# EAGLE design nonregulation-level-shifter-mk-2.1 (EAGLE 7.5.0)
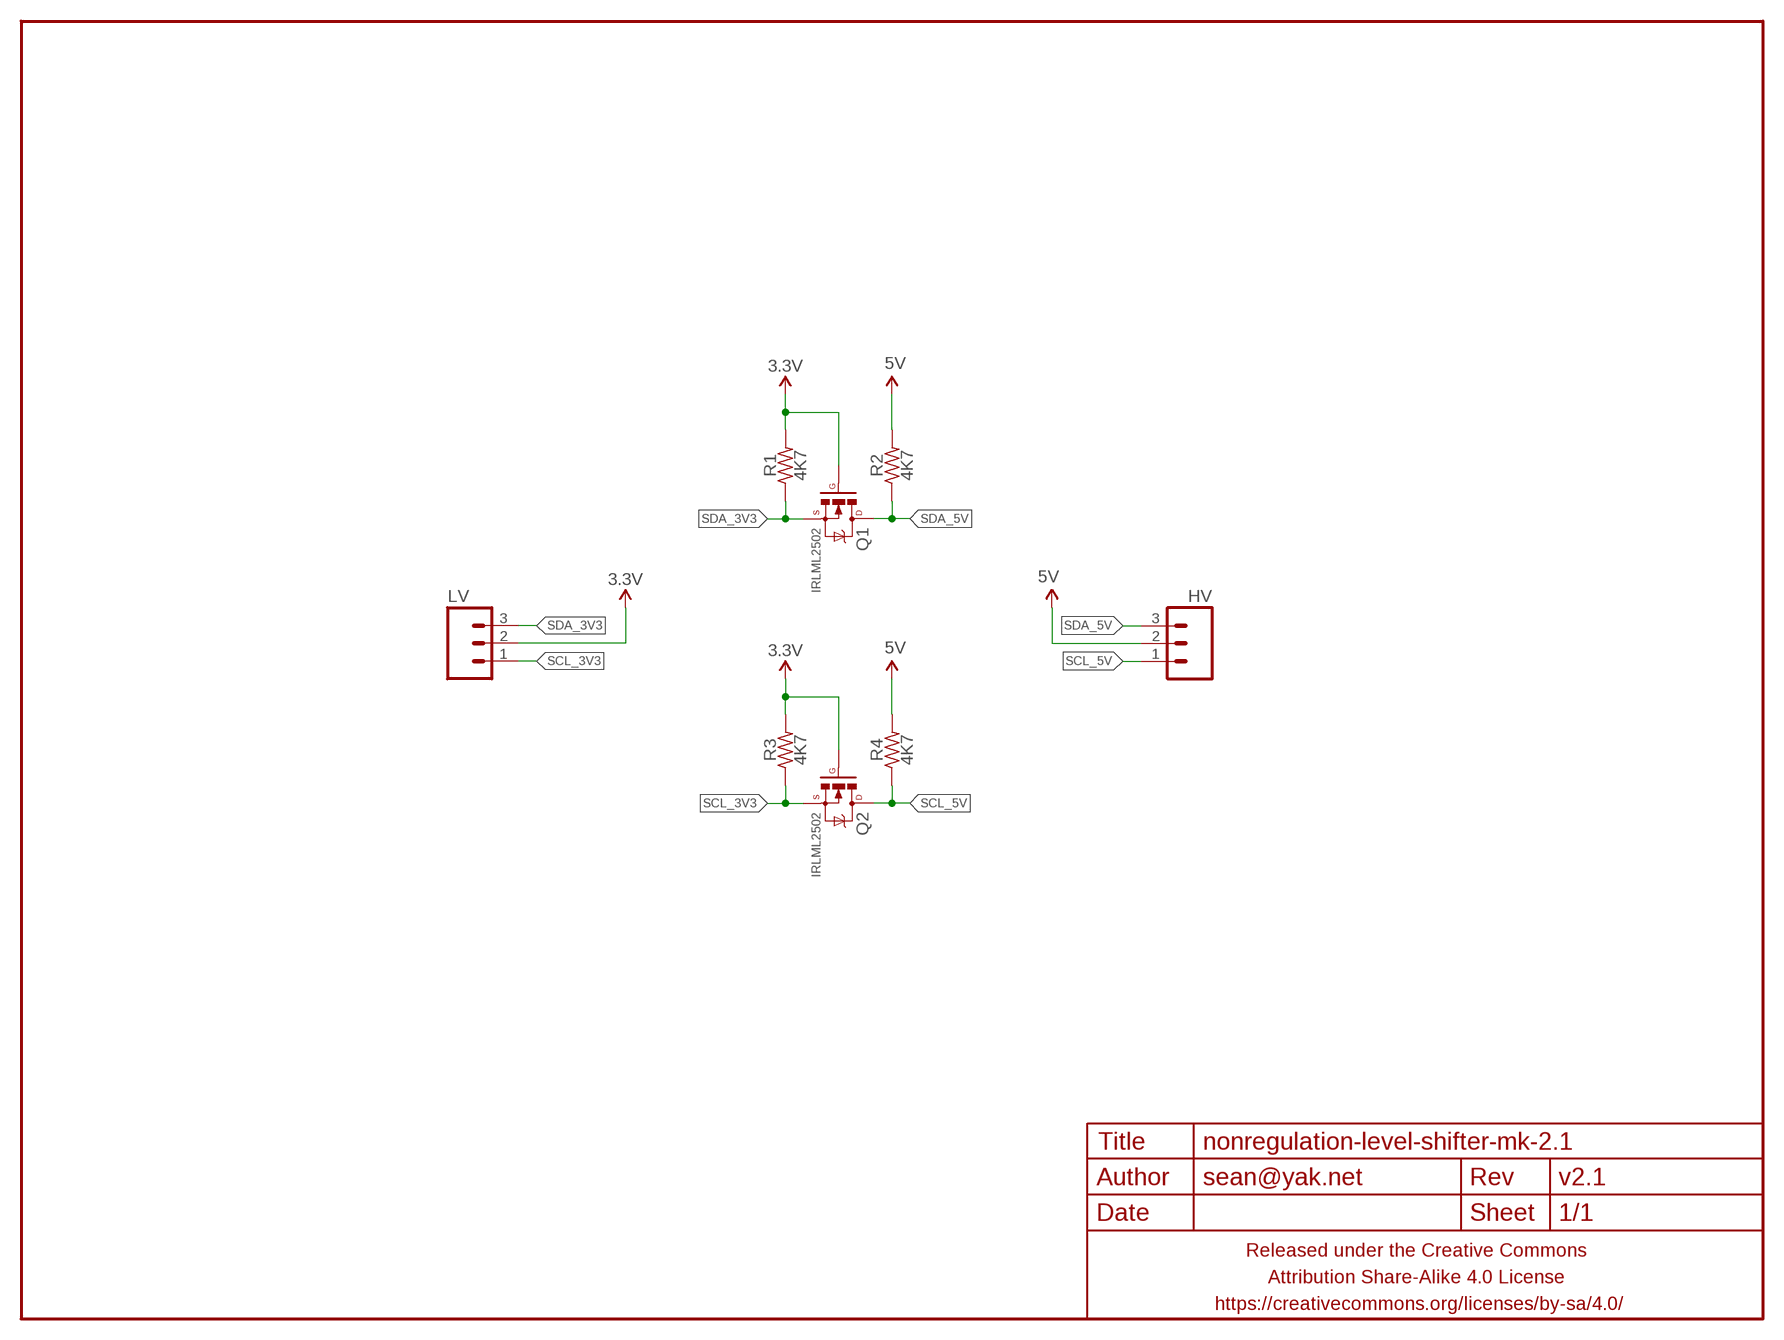
[diagram p0: schematic, sheet 1]

## Parts
FRAME1  FRAME-LETTERNO_PACKAGE  [DUMMY]
HV  M03PTH-CENTERED  [1X03-CENTERED]
LV  M03PTH-CENTERED  [1X03-CENTERED]
Q1  IRLML2502  MOSFET-NCHANNELIRLML2502  [SOT23]
Q2  IRLML2502  MOSFET-NCHANNELIRLML2502  [SOT23]
R1  4K7  RESISTORR0603  [R0603]
R2  4K7  RESISTORR0603  [R0603]
R3  4K7  RESISTORR0603  [R0603]
R4  4K7  RESISTORR0603  [R0603]

## Nets
3.3V: LV.2 Q1.1(G) Q2.1(G) R1.2 R3.2
5V: HV.2 R2.2 R4.2
SCL_3V3: LV.1 Q2.2(S) R3.1
SCL_5V: HV.1 Q2.3(D) R4.1
SDA_3V3: LV.3 Q1.2(S) R1.1
SDA_5V: HV.3 Q1.3(D) R2.1

## Library data of the parts
FRAME1 = A_butts:FRAME-LETTER: Schematic Frame Standard 8.5x11 US Letter frame; DESIGNER: sean@yak.net; VERSION: v2.1
HV LV = a_parts:M03: Header 3 Standard 3-pin 0.1" header. Use with straight break away headers (SKU : PRT-00116), right angle break away headers (PRT-00553), swiss pins (PRT-00743), machine pins (PRT-00117), and female headers (PRT-00115). Molex polarized connector foot print use with SKU : PRT-08232 with associated crimp pins and housings.
Q1 Q2 = a_parts:MOSFET-NCHANNEL: Common NMOSFET Parts MFG P/N Store ID Prod ID FDD8780 TRANS-09984 SI7820DN TRANS-11055 FDS6630A IC-08089 2N7002PW TRANS-11151 FQP30N06L COM-10213 TRANS-10060 BSS123LT1G TRANS-08345 BSS138 TRANS-00830 BS170 2N7000
R1-R4 = a_parts:RESISTOR: RESISTOR, American symbol

## Board
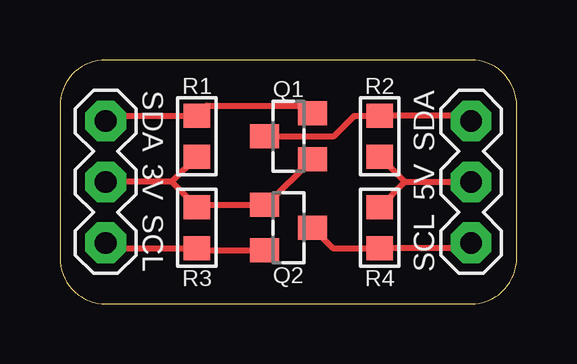
[diagram p1: board, top side]
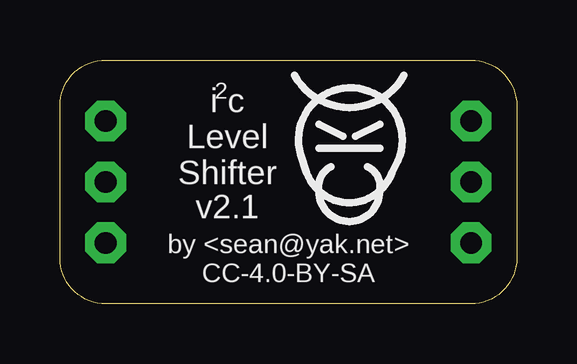
[diagram p2: board, bottom side, seen from below]

Size 19.05 x 10.16 mm. Coordinates in mm from the lower left corner, seen from the top.
Outline: 19.05,1.91 19.05,8.26 arc90 17.14,10.16 1.91,10.16 arc90 0,8.26 0,1.91 arc90 1.91,0 17.14,0 arc90 19.05,1.91
Copper layers (1*16): Top 0.0356mm / dielectric 1.5011mm / Bottom 0.0356mm
Design rules "LaenPCBOrder_2": minimum track width 6mil, minimum drill 13mil, track to track 6mil, track to pad 6mil, pad to pad 6mil, via to via 6mil, smd to smd 6mil, copper to edge 15mil, drill to drill 6mil, minimum pad ring 7mil, minimum via ring 7mil, stop-mask expansion 3mil, vias tented up to drill 20mil, thermal gap 10mil

### Footprints (pad centres in the part's own frame; a part is rotated, then mirrored left to right if it is on the bottom)
1X03-CENTERED = drill 0.9 pad 1.7 octagon: 1 -2.54,0; 2 0,0; 3 2.54,0
SOT23 = smd 1 x 1.2: 1 -0.95,-1; 2 0.95,-1; 3 0,1
R0603 = smd 1 x 1.1: 1 -0.85,0; 2 0.85,0

### Placement (x,y rotation side)
FRAME1  0,0 0 top
HV  17.14,5.08 90 top
LV  1.91,5.08 90 top
Q1  9.53,6.99 90 top
Q2  9.53,3.17 270 top
R1  5.71,6.99 270 top
R2  13.34,6.99 270 top
R3  5.71,3.17 90 top
R4  13.34,3.17 90 top
U$1  [COW_SMALL_NOTEXT]  6.99,6.99 0 bottom

### Tracks (layer width: path | path; a pad name or v marks a point on that pad's centre or on a via)
3.3V
  Top 0.254: Q1.1 8.62,4.12 Q2.1 5.82,4.12 R3.2 4.66,5.08 | R1.2 4.66,5.08 | LV.2 2.16,5.08 4.66,5.08
5V
  Top 0.254: R4.2 14.39,5.08 | R2.2 14.39,5.08 | 14.39,5.08 HV.2
SCL_3V3
  Top 0.254: LV.1 2.12,2.33 R3.1 5.82,2.23 Q2.2
SCL_5V
  Top 0.254: HV.1 16.93,2.33 R4.1 11.38,2.33 Q2.3
SDA_3V3
  Top 0.254: LV.3 2.12,7.83 R1.1 6.13,8.26 10.21,8.26 Q1.2
SDA_5V
  Top 0.254: Q1.3 11.43,6.99 12.28,7.83 R2.1 16.93,7.83 HV.3

### Text on the board
tPlace: SDA | SDA | 3V | 5V | SCL | SCL
bPlace: 2 | i c / Level / Shifter | by <sean@yak.net> / CC-4.0-BY-SA